# Altium project SNA.PrjPcb (part 2 of 2)

## Sheet 3 RF Source.SchDoc: RF Source
size A3; PageSetup: Record=PageOptions|CenterHorizontal=True|CenterVertical=True|PrintScale=1.01|XCorrection=1.00|YCorrection=1.00|PrintKind=2|BorderSize=5000000|LeftOffset=0|BottomOffset=0|Orientation=2|PaperLength=1000|PaperWidth=1000|Scale=100|PaperSource=15|PrintQuality=600|MediaType=1|DitherType=10|PaperKind=A3|PrintScaleMode=1; DocumentNumber: 4; SheetNumber: 4; SheetTotal: 7
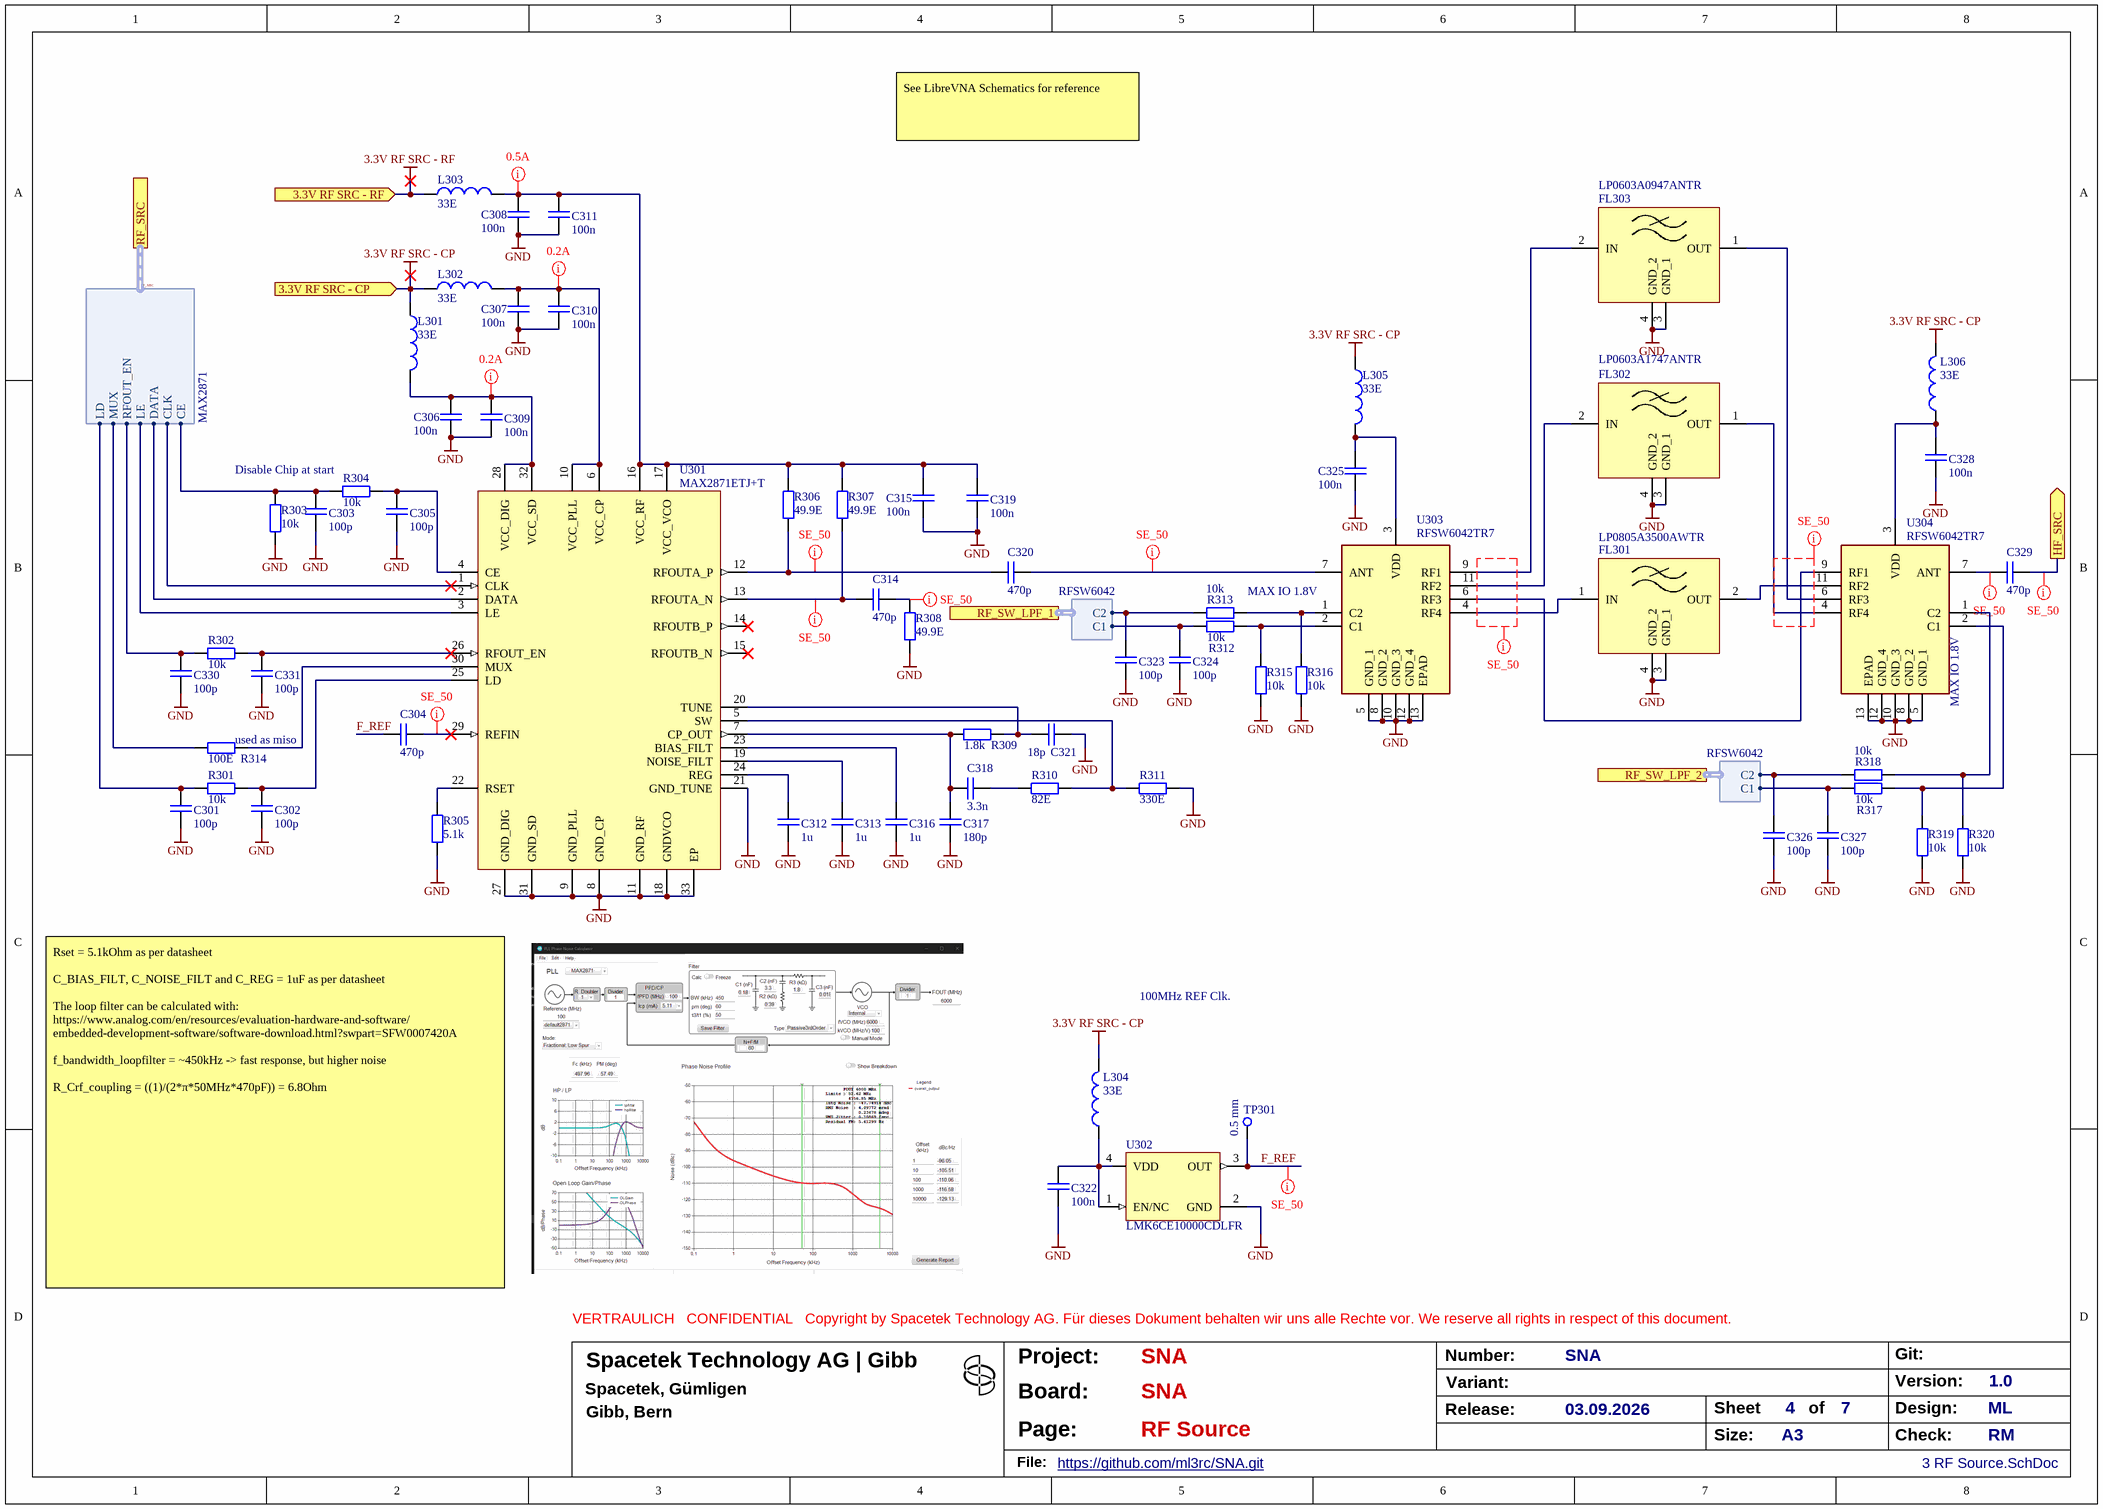
[diagram p3: 3 RF Source.SchDoc]

### Parts
C301  100p  [STT--CC--0402]
C302  100p  [STT--CC--0402]
C303  100p  [STT--CC--0402]
C304  470p  [STT--CC--0402]
C305  100p  [STT--CC--0402]
C306  100n  [STT--CC--0402]
C307  100n  [STT--CC--0402]
C308  100n  [STT--CC--0402]
C309  100n  [STT--CC--0402]
C310  100n  [STT--CC--0402]
C311  100n  [STT--CC--0402]
C312  1u  [STT--CC--0603]
C313  1u  [STT--CC--0603]
C314  470p  [STT--CC--0402]
C315  100n  [STT--CC--0402]
C316  1u  [STT--CC--0603]
C317  180p  [STT--CC--0402]
C318  3.3n  [STT--CC--0402]
C319  100n  [STT--CC--0402]
C320  470p  [STT--CC--0402]
C321  18p  [STT--CC--0402]
C322  100n  [STT--CC--0402]
C323  100p  [STT--CC--0402]
C324  100p  [STT--CC--0402]
C325  100n  [STT--CC--0402]
C326  100p  [STT--CC--0402]
C327  100p  [STT--CC--0402]
C328  100n  [STT--CC--0402]
C329  470p  [STT--CC--0402]
C330  100p  [STT--CC--0402]
C331  100p  [STT--CC--0402]
FL301  LP0805A3500AWTR  [KA--LP0805A]
FL302  LP0603A1747ANTR  [KA--LP0603A]
FL303  LP0603A0947ANTR  [KA--LP0603A]
L301  33E  [STT--FB--0402]
L302  33E  [STT--FB--0402]
L303  33E  [STT--FB--0402]
L304  33E  [STT--FB--0402]
L305  33E  [STT--FB--0402]
L306  33E  [STT--FB--0402]
R301  10k  [STT--RC--0402]
R302  10k  [STT--RC--0402]
R303  10k  [STT--RC--0402]
R304  10k  [STT--RC--0402]
R305  5.1k  [STT--RC--0402]
R306  49.9E  [STT--RC--0402]
R307  49.9E  [STT--RC--0402]
R308  49.9E  [STT--RC--0402]
R309  1.8k  [STT--RC--0402]
R310  82E  [STT--RC--0402]
R311  330E  [STT--RC--0402]
R312  10k  [STT--RC--0402]
R313  10k  [STT--RC--0402]
R314  100E  [STT--RC--0402]
R315  10k  [STT--RC--0402]
R316  10k  [STT--RC--0402]
R317  10k  [STT--RC--0402]
R318  10k  [STT--RC--0402]
R319  10k  [STT--RC--0402]
R320  10k  [STT--RC--0402]
TP301  0.5 mm  [STT--DO--TP-0.5]  (no BOM)
U301  MAX2871ETJ+T  [AD-IC-MAX2871ETJ+T]
U302  LMK6CE10000CDLFR  [TXI-IC-LMK6CE10000CDLFR]
U303  RFSW6042TR7  [QV--IC--QFN-12]
U304  RFSW6042TR7  [QV--IC--QFN-12]

### Ports
3.3V RF SRC - CP (in), 3.3V RF SRC - RF (in), HF_SRC (out), RF_SRC (harness MAX2871), RF_SW_LPF_1 (harness RFSW6042), RF_SW_LPF_2 (harness RFSW6042)

### Harnesses
RFSW6042: C1, C2
MAX2871: CE, CLK, DATA, LE, RFOUT_EN, MUX, LD

### Nets
3.3V RF SRC - CP: L301.1 L302.1 L304.2 L305.1 L306.1 ; port 3.3V RF SRC - CP
3.3V RF SRC - RF: L303.1 ; port 3.3V RF SRC - RF
GND: C301.1 C302.1 C303.1 C305.1 C306.2 C307.2 C308.2 C309.2 C310.2 C311.2 C312.1 C313.1 C315.2 C316.1 C317.1 C319.2 C321.2 C322.1 C323.1 C324.1 C325.2 C326.1 C327.1 C328.2 C330.1 C331.1 FL301.3(GND_1) FL301.4(GND_2) FL302.3(GND_1) FL302.4(GND_2) FL303.3(GND_1) FL303.4(GND_2) R303.2 R305.1 R308.1 R311.2 R315.2 R316.2 R319.2 R320.2 U301.8(GND_CP) U301.9(GND_PLL) U301.11(GND_RF) U301.18(GNDVCO) U301.21(GND_TUNE) U301.27(GND_DIG) U301.31(GND_SD) U301.33(EP) U302.2(GND) U303.5(GND_1) U303.8(GND_2) U303.10(GND_3) U303.12(GND_4) U303.13(EPAD) U304.5(GND_1) U304.8(GND_2) U304.10(GND_3) U304.12(GND_4) U304.13(EPAD)
F_REF: C304.1 TP301.1 U302.3(OUT)
RF_SRC.CE: C303.2 R303.1 R304.2 ; port RF_SRC.CE
RF_SRC.CLK: U301.1(CLK) ; port RF_SRC.CLK
RF_SRC.DATA: U301.2(DATA) ; port RF_SRC.DATA
RF_SRC.LD: C301.2 R301.2 ; port RF_SRC.LD
RF_SRC.LE: U301.3(LE) ; port RF_SRC.LE
RF_SRC.MUX: R314.1 ; port RF_SRC.MUX
RF_SRC.RFOUT_EN: C330.2 R302.2 ; port RF_SRC.RFOUT_EN
RF_SW_LPF_1.C1: C324.2 R312.1 ; port RF_SW_LPF_1.C1
RF_SW_LPF_1.C2: C323.2 R313.1 ; port RF_SW_LPF_1.C2
RF_SW_LPF_2.C1: C327.2 R317.1 ; port RF_SW_LPF_2.C1
RF_SW_LPF_2.C2: C326.2 R318.1 ; port RF_SW_LPF_2.C2
NetC302_2: C302.2 R301.1 U301.25(LD)
NetC304_2: C304.2 U301.29(REFIN)
NetC305_2: C305.2 R304.1 U301.4(CE)
NetC306_1: C306.1 C309.1 L301.2 U301.28(VCC_DIG) U301.32(VCC_SD)
NetC307_1: C307.1 C310.1 L302.2 U301.6(VCC_CP) U301.10(VCC_PLL)
NetC308_1: C308.1 C311.1 C315.1 C319.1 L303.2 R306.2 R307.2 U301.16(VCC_RF) U301.17(VCC_VCO)
NetC312_2: C312.2 U301.24(REG)
NetC313_2: C313.2 U301.19(NOISE_FILT)
NetC314_1: C314.1 R307.1 U301.13(RFOUTA_N)
NetC314_2: C314.2 R308.2
NetC316_2: C316.2 U301.23(BIAS_FILT)
NetC317_2: C317.2 C318.1 R309.1 U301.7(CP_OUT)
NetC318_2: C318.2 R310.2
NetC320_1: C320.1 R306.1 U301.12(RFOUTA_P)
NetC320_2: C320.2 U303.7(ANT)
NetC321_1: C321.1 R309.2 U301.20(TUNE)
NetC322_2: C322.2 L304.1 U302.1(EN/NC) U302.4(VDD)
NetC325_1: C325.1 L305.2 U303.3(VDD)
NetC328_1: C328.1 L306.2 U304.3(VDD)
NetC329_1: C329.1 U304.7(ANT)
NetC329_2: C329.2 ; port HF_SRC
NetC331_2: C331.2 R302.1 U301.26(RFOUT_EN)
NetFL301_1: FL301.1(IN) U303.4(RF4)
NetFL301_2: FL301.2(OUT) U304.11(RF2)
NetFL302_1: FL302.1(OUT) U304.4(RF4)
NetFL302_2: FL302.2(IN) U303.11(RF2)
NetFL303_1: FL303.1(OUT) U304.6(RF3)
NetFL303_2: FL303.2(IN) U303.9(RF1)
NetR305_2: R305.2 U301.22(RSET)
NetR310_1: R310.1 R311.1 U301.5(SW)
NetR312_2: R312.2 R315.1 U303.2(C1)
NetR313_2: R313.2 R316.1 U303.1(C2)
NetR314_2: R314.2 U301.30(MUX)
NetR317_2: R317.2 R319.1 U304.2(C1)
NetR318_2: R318.2 R320.1 U304.1(C2)
NetU303_6: U303.6(RF3) U304.9(RF1)

Not connected (* = marked no-connect by the designer): U301 14(RFOUTB_P)* 15(RFOUTB_N)*

### Buses and harness runs
harness RF_SRC = port RF_SRC
harness RF_SW_LPF_1 = port RF_SW_LPF_1
harness RF_SW_LPF_2 = port RF_SW_LPF_2

### Layout directives
net class SE_50: (no net found under the mark), F_REF, NetC304_2, NetC314_1, NetC314_2, NetC320_1, NetC320_2, NetC329_1, NetC329_2
net class 0.5A: NetC308_1
net class 0.2A: NetC306_1, NetC307_1

### Notes on the sheet
- See LibreVNA Schematics for reference
- (near R304) Disable Chip at start
- MAX IO 1.8V
- (near U304) MAX IO 1.8V
- (near R314) used as miso
- 100MHz REF Clk.
- Rset = 5.1kOhm as per datasheet
  C_BIAS_FILT, C_NOISE_FILT and C_REG = 1uF as per datasheet
  The loop filter can be calculated with:
  https://www.analog.com/en/resources/evaluation-hardware-and-software/
  embedded-development-software/software-download.html?swpart=SFW0007420A
  f_bandwidth_loopfilter = ~450kHz -> fast response, but higher noise
  R_Crf_coupling = ((1)/(2*π*50MHz*470pF)) = 6.8Ohm
- VERTRAULICH   CONFIDENTIAL   Copyright by Spacetek Technology AG. Für dieses Dokument behalten wir uns alle Rechte vor. We reserve all rights in respect of this document.
- Project:
- Number:
- Variant:
- Version:
- Git:
- Board:
- Page:
- Release:
- Size:
- Sheet
- A3
- of
- Design:
- Check:
- File:

### Library data of the parts
C301-C303 C305 C323 C324 C326 C327 C330 C331 = CMP-010-000109-1: as C105 on sheet 1 Power; Package: SMD--0402; Status: released; Type: Capacitor ceramic; Value: 100p
C304 C314 C320 C329 = CMP-010-000105-1: Capacitor ceramic 470p 50V 5% C0G  SMD--0402; Manufacturer: TDK; Partnumber: CGA2B2C0G1H471J050BA; Component Category: Generic; Meta Data Version: v1.0; Status: released; Value: 470p
C306-C311 C315 C319 C322 C325 C328 = 200032-3: as C127 on sheet 1 Power; Material: X7R; Voltage: 16V; Type: Capacitor ceramic; Tolerance: 10%; Status: released; Package: SMD--0402; Value: 100n
C312 C313 C316 = CMP-010-000042-2: CAP CER 1UF 35V X7R 0603 10%; Manufacturer: TDK Corporation; Partnumber: C1608X7R1V105K080AC; Special: 0603 SMD; Value: 1u; E-Nummer: -; Status: released
C317 = CMP-010-000104-2: Capacitor ceramic 180p 50V 5% C0G  SMD--0402; Partnumber: CL05C181JB5NNNC; Manufacturer: Samsung Electro-Mechanics; Component Category: Generic; Meta Data Version: v1.0; Value: 180p; Tolerance: 5%; Status: released; Type: Capacitor ceramic; Voltage: 50V; Material: C0G; Package: SMD--0402
C318 = CMP-010-000108-1: Capacitor ceramic 3.3n 50V 10% X7R AEC-Q200 SMD--0402; Partnumber: CL05B332KB5VPNC; Manufacturer: Samsung Electro-Mechanics; Component Category: Generic; Meta Data Version: v1.0; Package: SMD--0402; Status: released; Value: 3.3n; Type: Capacitor ceramic
C321 = 200042-1: Capacitor ceramic 18p 50V 5% C0G  SMD--0402; Partnumber: CL05C180JB5NNNC; Manufacturer: Samsung Electro-Mechanics; A-Number: 200042; Voltage: 50V; Type: Capacitor ceramic; Tolerance: 5%; Package: SMD--0402; Material: C0G; Status: released; Value: 18p
FL301 = CMP-011-000006-1: Low Pass Filter 3500MHz 50 Ohms; Manufacturer: KYOCERA AVX; Component Category: Generic; Meta Data Version: v1.0; Partnumber: LP0805A3500AWTR; Value: LP0805A3500AWTR; Status: released
FL302 = CMP-011-000005-4: Low Pass Filter 1747MHz 50 Ohms; Manufacturer: KYOCERA AVX; Component Category: Generic; Meta Data Version: v1.0; Partnumber: LP0603A1747ANTR; Status: released; Value: LP0603A1747ANTR
FL303 = CMP-011-000007-2: Low Pass Filter 947MHz 50 Ohms; Manufacturer: KYOCERA AVX; Component Category: Generic; Meta Data Version: v1.0; Partnumber: LP0603A0947ANTR; Value: LP0603A0947ANTR; Status: released
L301-L306 = 300015-1: as L105 on sheet 1 Power; Status: active; Current: 3A; Type: Ferrit Bead; Value: 33E; Package: MPZ1005S330HT000; Special: 22mE; Partnumber: MPZ1005S330HT000
R301-R304 R312 R313 R315-R320 = 100086-1: as R204 on sheet 2 MCU; Power: 0.063W; Status: released; Type: Resistor; Voltage: 50V; Tolerance: 1%; Value: 10k; Package: SMD--0402
R305 = CMP-009-000042-2: Resistor 5.1k 50V  0.063W 1%  SMD--0402; Partnumber: ERJ-2RKF5101X; Manufacturer: Panasonic; Value: 5.1k; Tolerance: 1%; Package: SMD--0402; Power: 0.063W; Status: released; Voltage: 50V; Type: Resistor
R306-R308 = CMP-009-000262-1: Resistor 49.9E 50V 0.1W 1% SMD--0402; Partnumber: RNCP0402FTD49R9; Manufacturer: SEI Stackpole; Component Category: Generic; Meta Data Version: v1.0; Value: 49.9E; Status: released
R309 = CMP-009-000258-1: Resistor 1.8k 50V  0.063W 1%  SMD--0402; Manufacturer: SEI Stackpole; Partnumber: RMCF0402FT1K80; Component Category: Generic; Meta Data Version: v1.0; Power: 0.063W; Package: SMD--0402; Value: 1.8k; Voltage: 50V; Type: Resistor; Tolerance: 1%; Status: released
R310 = CMP-009-000257-2: Resistor 82E 25V  0.063W 0.5%  SMD--0402; Partnumber: RR0510R-820-D; Manufacturer: Vishay; Meta Data Version: v1.0; Component Category: Generic; Type: Resistor; Status: released; Value: 82E
R311 = 100076-2: Resistor 330E 50V  0.063W 1%  SMD--0402; Partnumber: ERJ-2RKF3300X; Manufacturer: Panasonic; A-Number: 100076; Power: 0.063W; Type: Resistor; Voltage: 50V; Value: 330E; Package: SMD--0402; Tolerance: 1%; Status: released
R314 = 100068-1: Resistor 100E 50V  0.063W 0.01  SMD--0402; Partnumber: CRCW0402100RFKEDC; Manufacturer: Vishay; A-Number: 100068; Tolerance: 0.01; Power: 0.063W; Package: SMD--0402; Value: 100E; Status: released; Type: Resistor; Voltage: 50V
TP301 = CMP-043-000000-4: Pad TP SMD--Pad 0.5; Special: 0.5; preferred: Yes; Status: active; Partnumber: TP; Value: 0.5 mm; Package: SMD--Pad; Type: Pad
U301 = CMP-038-000007-2: MAX2871ETJ+T PLL 23.5MHz to 6000MHz; Manufacturer: Analog Devices; Meta Data Version: v1.0; Component Category: generic; Type: Oscillator; Partnumber: MAX2871ETJ+T; Status: released; Value: 23.5MHz to 6000MHz
U302 = CMP-038-000005-2: LMK6CE10000CDLFR low jitter 100MHz 3.3V LVCMOS, no load max.: 62mA; Manufacturer: Texas Instruments; Meta Data Version: Meta Data Version v1.0; Voltage: 2.5V - 3.3 V; Component Category: Generic; Value: 100 MHz; Special: LVCMOS; Type: Oscillator; Status: released; Partnumber: LMK6CE10000CDLFR
U303 U304 = CMP-081-000011-1: RF Switch RFSW6042TR7  5-6000MHz SP4T Iso 36dB @925MHz; Manufacturer: Qorvo; Component Category: Generic; Meta Data Version: v1.0; Partnumber: RFSW6042TR7; Status: released; Value: RFSW6042TR7; Type: RF-Switch

## Sheet 4 RF Attenuation Amp.SchDoc: RF Attenuation Amp
size A3; PageSetup: Record=PageOptions|CenterHorizontal=True|CenterVertical=True|PrintScale=1.01|XCorrection=1.00|YCorrection=1.00|PrintKind=2|BorderSize=5000000|LeftOffset=0|BottomOffset=0|Orientation=2|PaperLength=1000|PaperWidth=1000|Scale=100|PaperSource=15|PrintQuality=600|MediaType=1|DitherType=10|PaperKind=A3|PrintScaleMode=1; DocumentNumber: 4; SheetNumber: 5; SheetTotal: 7
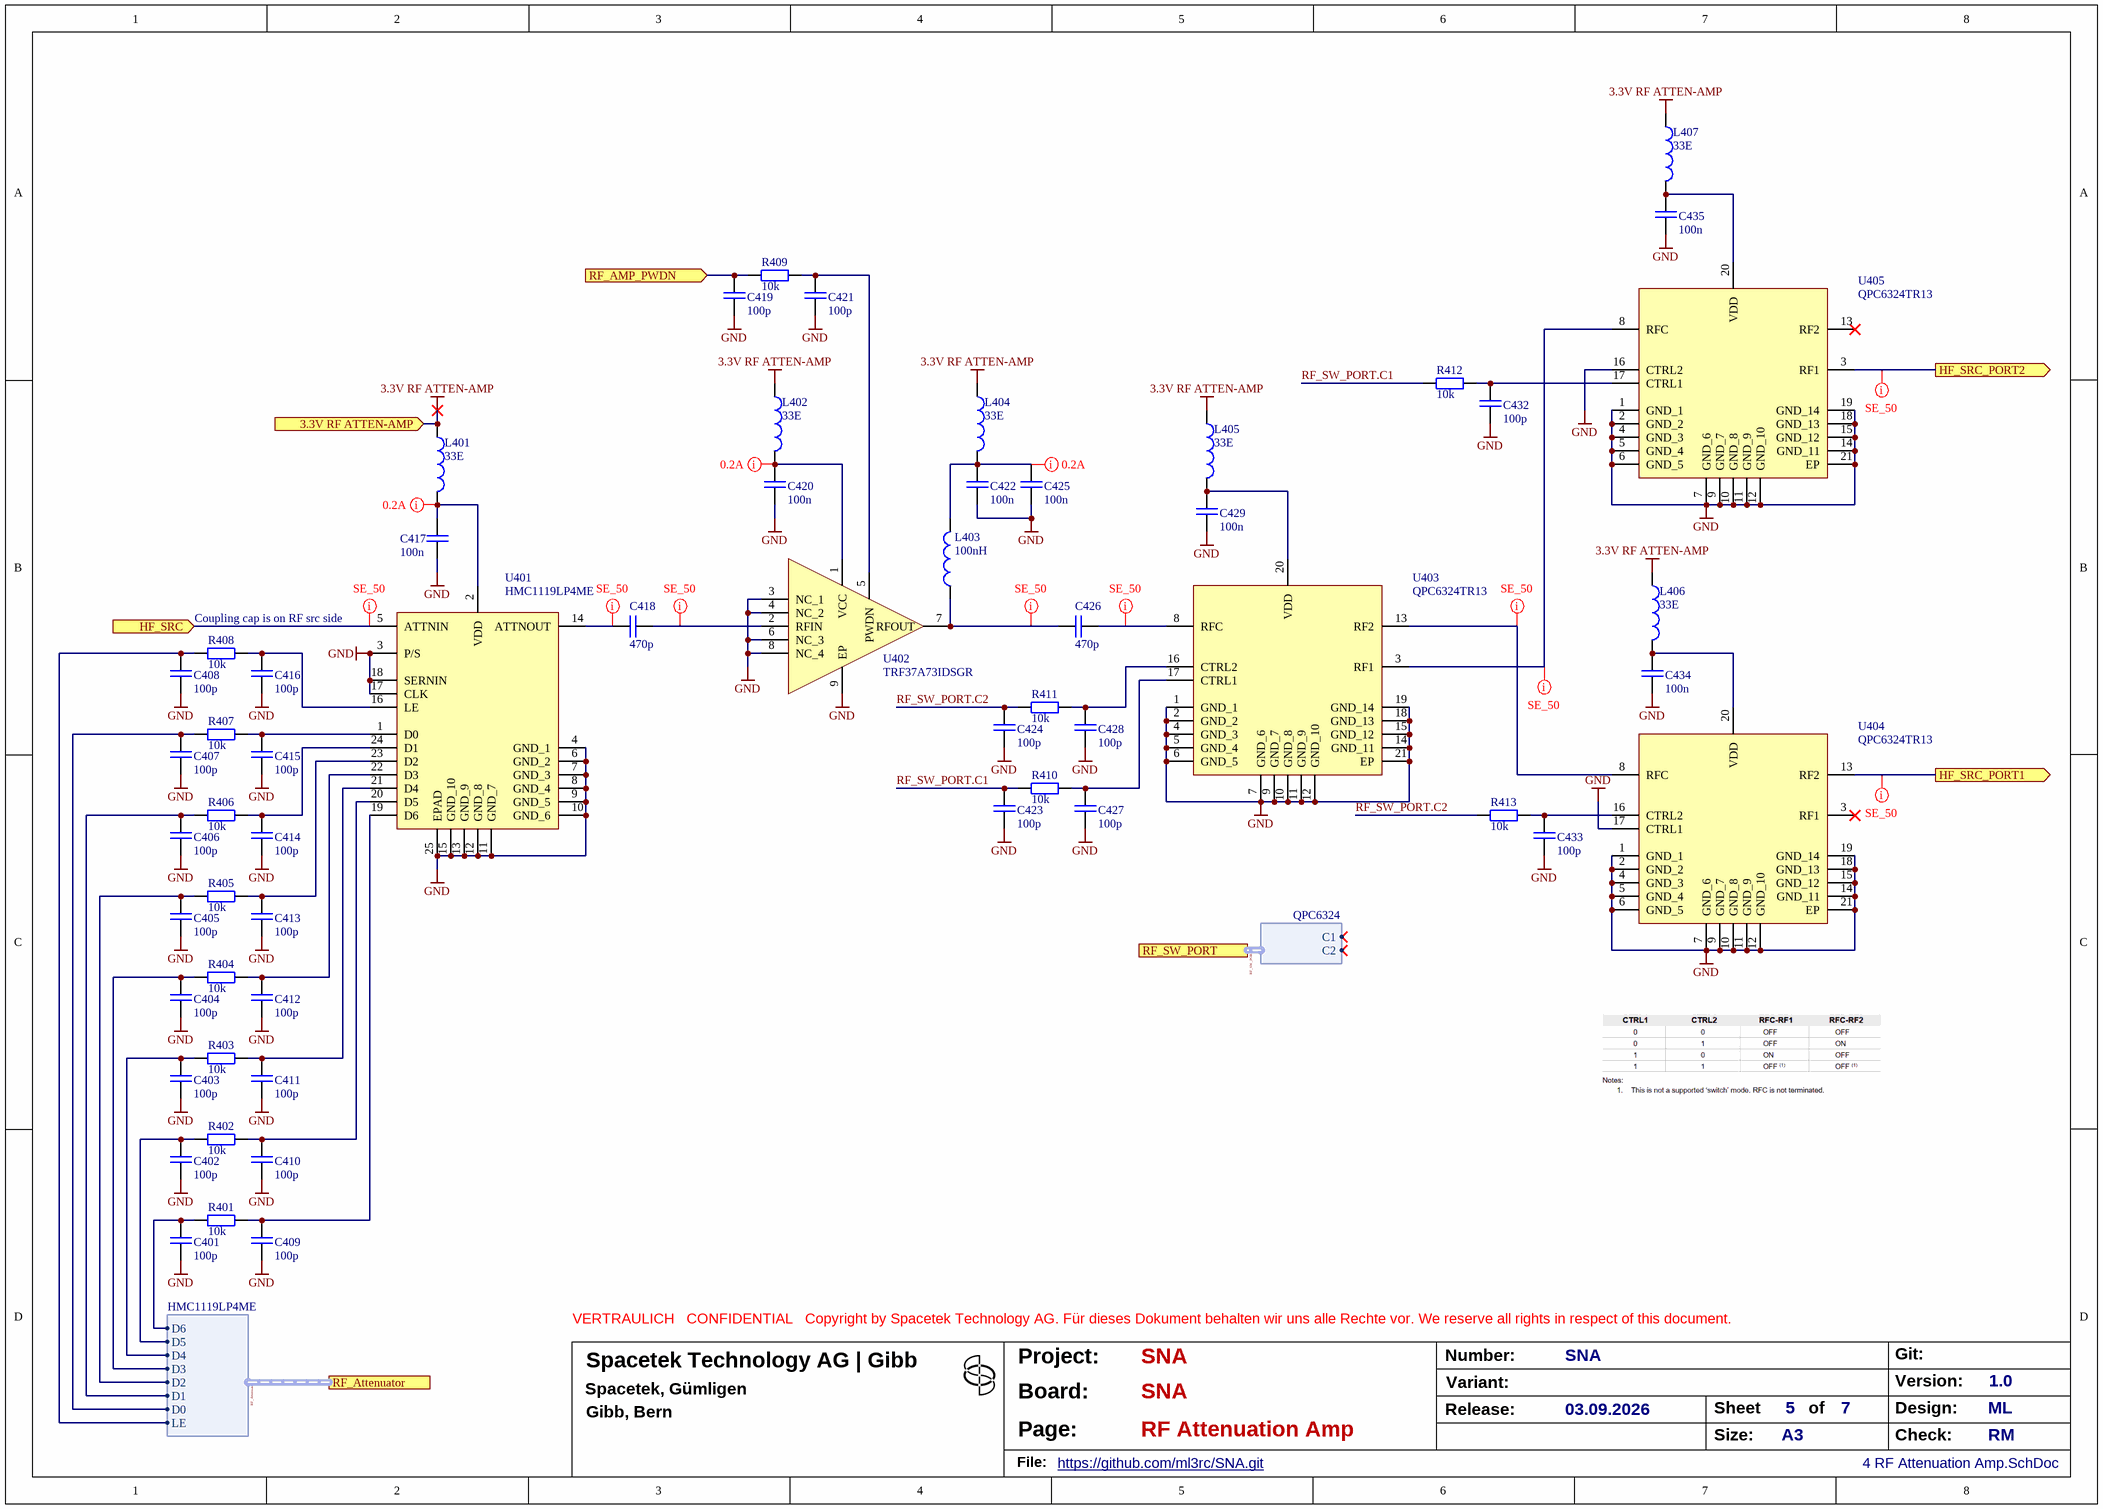
[diagram p4: 4 RF Attenuation Amp.SchDoc]

### Parts
C401  100p  [STT--CC--0402]
C402  100p  [STT--CC--0402]
C403  100p  [STT--CC--0402]
C404  100p  [STT--CC--0402]
C405  100p  [STT--CC--0402]
C406  100p  [STT--CC--0402]
C407  100p  [STT--CC--0402]
C408  100p  [STT--CC--0402]
C409  100p  [STT--CC--0402]
C410  100p  [STT--CC--0402]
C411  100p  [STT--CC--0402]
C412  100p  [STT--CC--0402]
C413  100p  [STT--CC--0402]
C414  100p  [STT--CC--0402]
C415  100p  [STT--CC--0402]
C416  100p  [STT--CC--0402]
C417  100n  [STT--CC--0402]
C418  470p  [STT--CC--0402]
C419  100p  [STT--CC--0402]
C420  100n  [STT--CC--0402]
C421  100p  [STT--CC--0402]
C422  100n  [STT--CC--0402]
C423  100p  [STT--CC--0402]
C424  100p  [STT--CC--0402]
C425  100n  [STT--CC--0402]
C426  470p  [STT--CC--0402]
C427  100p  [STT--CC--0402]
C428  100p  [STT--CC--0402]
C429  100n  [STT--CC--0402]
C432  100p  [STT--CC--0402]
C433  100p  [STT--CC--0402]
C434  100n  [STT--CC--0402]
C435  100n  [STT--CC--0402]
L401  33E  [STT--FB--0402]
L402  33E  [STT--FB--0402]
L403  100nH  [STT--RC--0603]
L404  33E  [STT--FB--0402]
L405  33E  [STT--FB--0402]
L406  33E  [STT--FB--0402]
L407  33E  [STT--FB--0402]
R401  10k  [STT--RC--0402]
R402  10k  [STT--RC--0402]
R403  10k  [STT--RC--0402]
R404  10k  [STT--RC--0402]
R405  10k  [STT--RC--0402]
R406  10k  [STT--RC--0402]
R407  10k  [STT--RC--0402]
R408  10k  [STT--RC--0402]
R409  10k  [STT--RC--0402]
R410  10k  [STT--RC--0402]
R411  10k  [STT--RC--0402]
R412  10k  [STT--RC--0402]
R413  10k  [STT--RC--0402]
U401  HMC1119LP4ME  [ADI--IC--LFCSP-24]
U402  TRF37A73IDSGR  [TI--IC--WSON-8]
U403  QPC6324TR13  [QV--IC--QFN-20]
U404  QPC6324TR13  [QV--IC--QFN-20]
U405  QPC6324TR13  [QV--IC--QFN-20]

### Ports
3.3V RF ATTEN-AMP (in), HF_SRC (in), HF_SRC_PORT1 (out), HF_SRC_PORT2 (out), RF_AMP_PWDN (in), RF_Attenuator (harness HMC1119LP4ME), RF_SW_PORT (harness QPC6324)

### Harnesses
HMC1119LP4ME: D6, D5, D4, D3, D2, D1, LE, D0
QPC6324: C1, C2

### Nets
3.3V RF ATTEN-AMP: L401.1 L402.1 L404.1 L405.1 L406.1 L407.1 ; port 3.3V RF ATTEN-AMP
GND: C401.1 C402.1 C403.1 C404.1 C405.1 C406.1 C407.1 C408.1 C409.1 C410.1 C411.1 C412.1 C413.1 C414.1 C415.1 C416.1 C417.2 C419.1 C420.1 C421.1 C422.1 C423.1 C424.1 C425.1 C427.1 C428.1 C429.1 C432.1 C433.1 C434.1 C435.1 U401.3(P/S) U401.4(GND_1) U401.6(GND_2) U401.7(GND_3) U401.8(GND_4) U401.9(GND_5) U401.10(GND_6) U401.11(GND_7) U401.12(GND_8) U401.13(GND_9) U401.15(GND_10) U401.17(CLK) U401.18(SERNIN) U401.25(EPAD) U402.3(NC_1) U402.4(NC_2) U402.6(NC_3) U402.8(NC_4) U402.9(EP) U403.1(GND_1) U403.2(GND_2) U403.4(GND_3) U403.5(GND_4) U403.6(GND_5) U403.7(GND_6) U403.9(GND_7) U403.10(GND_8) U403.11(GND_9) U403.12(GND_10) U403.14(GND_11) U403.15(GND_12) U403.18(GND_13) U403.19(GND_14) U403.21(EP) U404.1(GND_1) U404.2(GND_2) U404.4(GND_3) U404.5(GND_4) U404.6(GND_5) U404.7(GND_6) U404.9(GND_7) U404.10(GND_8) U404.11(GND_9) U404.12(GND_10) U404.14(GND_11) U404.15(GND_12) U404.17(CTRL1) U404.18(GND_13) U404.19(GND_14) U404.21(EP) U405.1(GND_1) U405.2(GND_2) U405.4(GND_3) U405.5(GND_4) U405.6(GND_5) U405.7(GND_6) U405.9(GND_7) U405.10(GND_8) U405.11(GND_9) U405.12(GND_10) U405.14(GND_11) U405.15(GND_12) U405.16(CTRL2) U405.18(GND_13) U405.19(GND_14) U405.21(EP)
RF_Attenuator.D0: C407.2 R407.2 ; port RF_Attenuator.D0
RF_Attenuator.D1: C406.2 R406.2 ; port RF_Attenuator.D1
RF_Attenuator.D2: C405.2 R405.2 ; port RF_Attenuator.D2
RF_Attenuator.D3: C404.2 R404.2 ; port RF_Attenuator.D3
RF_Attenuator.D4: C403.2 R403.2 ; port RF_Attenuator.D4
RF_Attenuator.D5: C402.2 R402.2 ; port RF_Attenuator.D5
RF_Attenuator.D6: C401.2 R401.2 ; port RF_Attenuator.D6
RF_Attenuator.LE: C408.2 R408.2 ; port RF_Attenuator.LE
RF_SW_PORT.C1: C423.2 R410.2 R412.2
RF_SW_PORT.C2: C424.2 R411.2 R413.2
NetC329_2: U401.5(ATTNIN) ; port HF_SRC
NetC409_2: C409.2 R401.1 U401.19(D6)
NetC410_2: C410.2 R402.1 U401.20(D5)
NetC411_2: C411.2 R403.1 U401.21(D4)
NetC412_2: C412.2 R404.1 U401.22(D3)
NetC413_2: C413.2 R405.1 U401.23(D2)
NetC414_2: C414.2 R406.1 U401.24(D1)
NetC415_2: C415.2 R407.1 U401.1(D0)
NetC416_2: C416.2 R408.1 U401.16(LE)
NetC417_1: C417.1 L401.2 U401.2(VDD)
NetC418_1: C418.1 U401.14(ATTNOUT)
NetC418_2: C418.2 U402.2(RFIN)
NetC419_2: C419.2 R409.1 ; port RF_AMP_PWDN
NetC420_2: C420.2 L402.2 U402.1(VCC)
NetC421_2: C421.2 R409.2 U402.5(PWDN)
NetC422_2: C422.2 C425.2 L403.2 L404.2
NetC426_1: C426.1 L403.1 U402.7(RFOUT)
NetC426_2: C426.2 U403.8(RFC)
NetC427_2: C427.2 R410.1 U403.17(CTRL1)
NetC428_2: C428.2 R411.1 U403.16(CTRL2)
NetC429_2: C429.2 L405.2 U403.20(VDD)
NetC432_2: C432.2 R412.1 U405.17(CTRL1)
NetC433_2: C433.2 R413.1 U404.16(CTRL2)
NetC434_2: C434.2 L406.2 U404.20(VDD)
NetC435_2: C435.2 L407.2 U405.20(VDD)
NetC501_1: U405.3(RF1) ; port HF_SRC_PORT2
NetC502_1: U404.13(RF2) ; port HF_SRC_PORT1
NetU403_3: U403.3(RF1) U405.8(RFC)
NetU403_13: U403.13(RF2) U404.8(RFC)

Not connected (* = marked no-connect by the designer): U404 3(RF1)*; U405 13(RF2)*

### Buses and harness runs
harness RF_Attenuator = port RF_Attenuator
harness RF_SW_PORT = port RF_SW_PORT

### Layout directives
net class SE_50: NetC329_2, NetC418_1, NetC418_2, NetC426_1, NetC426_2, NetC501_1, NetC502_1, NetU403_3, NetU403_13
net class 0.2A: NetC417_1, NetC420_2, NetC422_2

### Notes on the sheet
- Coupling cap is on RF src side
- VERTRAULICH   CONFIDENTIAL   Copyright by Spacetek Technology AG. Für dieses Dokument behalten wir uns alle Rechte vor. We reserve all rights in respect of this document.
- Project:
- Number:
- Variant:
- Version:
- Git:
- Board:
- Page:
- Release:
- Size:
- Sheet
- A3
- of
- Design:
- Check:
- File:

### Library data of the parts
C401-C416 C419 C421 C423 C424 C427 C428 C432 C433 = CMP-010-000109-1: as C105 on sheet 1 Power; Package: SMD--0402; Status: released; Type: Capacitor ceramic; Value: 100p
C417 C420 C422 C425 C429 C434 C435 = 200032-3: as C127 on sheet 1 Power; Material: X7R; Voltage: 16V; Type: Capacitor ceramic; Tolerance: 10%; Status: released; Package: SMD--0402; Value: 100n
C418 C426 = CMP-010-000105-1: as C304 on sheet 3 RF Source; Status: released; Value: 470p
L401 L402 L404-L407 = 300015-1: as L105 on sheet 1 Power; Status: active; Current: 3A; Type: Ferrit Bead; Value: 33E; Package: MPZ1005S330HT000; Special: 22mE; Partnumber: MPZ1005S330HT000
L403 = CMP-012-000031-2: Inductor 100nH 290mA AEC-Q200  SMD--0603; Manufacturer: Coilcraft; Partnumber: 0603DC-R10XJRW; Component Category: generic; Meta Data Version: v1.0; Type: Inductor; Status: released; Value: 100nH
R401-R413 = 100086-1: as R204 on sheet 2 MCU; Power: 0.063W; Status: released; Type: Resistor; Voltage: 50V; Tolerance: 1%; Value: 10k; Package: SMD--0402
U401 = CMP-153-000013-1: Attenuator HMC1119LP4ME, -2...-32dBm, 0.1-6Ghz; Manufacturer: Analog Devices; Component Category: Generic; Meta Data Version: v1.0; Status: released; Value: HMC1119LP4ME; Partnumber: HMC1119LP4ME; Type: Attenuator
U402 = CMP-153-000014-1: Amp TRF37A73IDSGR, +12dB, 0.1-6Ghz; Manufacturer: Texas Instruments; Component Category: Generic; Meta Data Version: v1.0; Type: Amp; Partnumber: TRF37A73IDSGR; Status: released; Value: TRF37A73IDSGR
U403-U405 = CMP-081-000012-1: RF Switch QPC6324TR13  5-6000MHz SPDT; Manufacturer: Qorvo; Component Category: Generic; Meta Data Version: v1.0; Value: QPC6324TR13; Partnumber: QPC6324TR13; Status: released; Type: RF-Switch

## Sheet 5 RF Directional Coupler.SchDoc: RF Directional Coupler
size A3; PageSetup: Record=PageOptions|CenterHorizontal=True|CenterVertical=True|PrintScale=1.01|XCorrection=1.00|YCorrection=1.00|PrintKind=2|BorderSize=5000000|LeftOffset=0|BottomOffset=0|Orientation=2|PaperLength=1000|PaperWidth=1000|Scale=100|PaperSource=15|PrintQuality=600|MediaType=1|DitherType=10|PaperKind=A3|PrintScaleMode=1; DocumentNumber: 4; SheetNumber: 6; SheetTotal: 7
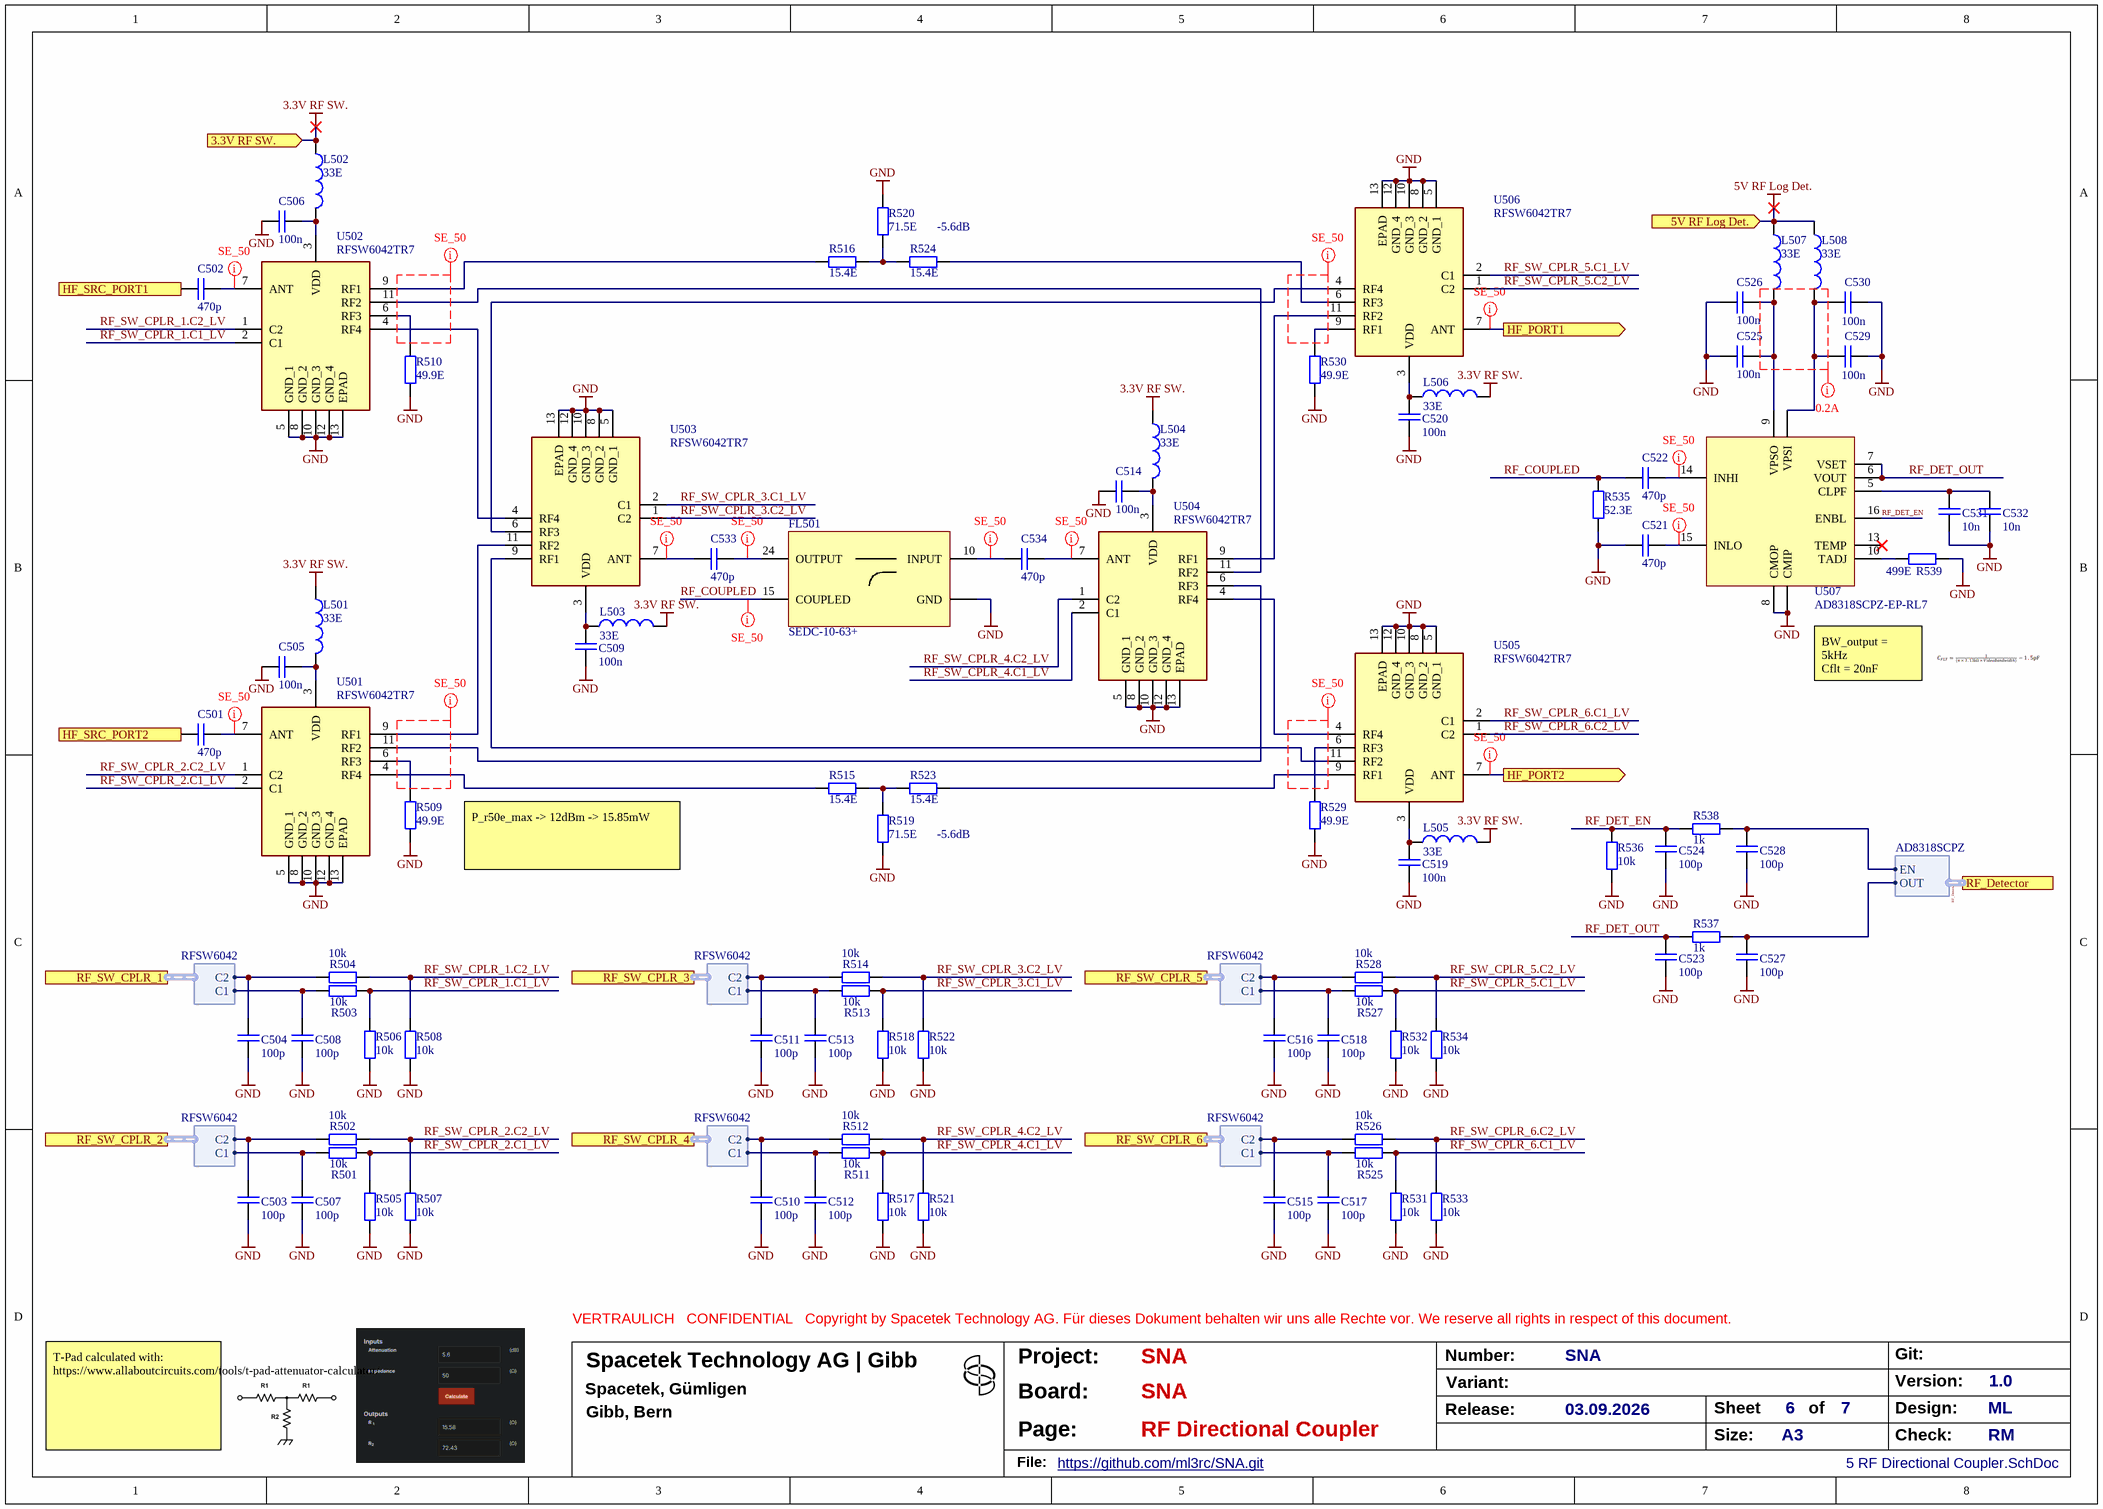
[diagram p5: 5 RF Directional Coupler.SchDoc]

### Parts
C501  470p  [STT--CC--0402]
C502  470p  [STT--CC--0402]
C503  100p  [STT--CC--0402]
C504  100p  [STT--CC--0402]
C505  100n  [STT--CC--0402]
C506  100n  [STT--CC--0402]
C507  100p  [STT--CC--0402]
C508  100p  [STT--CC--0402]
C509  100n  [STT--CC--0402]
C510  100p  [STT--CC--0402]
C511  100p  [STT--CC--0402]
C512  100p  [STT--CC--0402]
C513  100p  [STT--CC--0402]
C514  100n  [STT--CC--0402]
C515  100p  [STT--CC--0402]
C516  100p  [STT--CC--0402]
C517  100p  [STT--CC--0402]
C518  100p  [STT--CC--0402]
C519  100n  [STT--CC--0402]
C520  100n  [STT--CC--0402]
C521  470p  [STT--CC--0402]
C522  470p  [STT--CC--0402]
C523  100p  [STT--CC--0402]
C524  100p  [STT--CC--0402]
C525  100n  [STT--CC--0402]
C526  100n  [STT--CC--0402]
C527  100p  [STT--CC--0402]
C528  100p  [STT--CC--0402]
C529  100n  [STT--CC--0402]
C530  100n  [STT--CC--0402]
C531  10n  [STT--CC--0402]
C532  10n  [STT--CC--0402]
C533  470p  [STT--CC--0402]
C534  470p  [STT--CC--0402]
FL501  SEDC-10-63+  [MC--SEDC-10-63+]
L501  33E  [STT--FB--0402]
L502  33E  [STT--FB--0402]
L503  33E  [STT--FB--0402]
L504  33E  [STT--FB--0402]
L505  33E  [STT--FB--0402]
L506  33E  [STT--FB--0402]
L507  33E  [STT--FB--0402]
L508  33E  [STT--FB--0402]
R501  10k  [STT--RC--0402]
R502  10k  [STT--RC--0402]
R503  10k  [STT--RC--0402]
R504  10k  [STT--RC--0402]
R505  10k  [STT--RC--0402]
R506  10k  [STT--RC--0402]
R507  10k  [STT--RC--0402]
R508  10k  [STT--RC--0402]
R509  49.9E  [STT--RC--0402]
R510  49.9E  [STT--RC--0402]
R511  10k  [STT--RC--0402]
R512  10k  [STT--RC--0402]
R513  10k  [STT--RC--0402]
R514  10k  [STT--RC--0402]
R515  15.4E  [STT--RC--0402]
R516  15.4E  [STT--RC--0402]
R517  10k  [STT--RC--0402]
R518  10k  [STT--RC--0402]
R519  71.5E  [STT--RC--0402]
R520  71.5E  [STT--RC--0402]
R521  10k  [STT--RC--0402]
R522  10k  [STT--RC--0402]
R523  15.4E  [STT--RC--0402]
R524  15.4E  [STT--RC--0402]
R525  10k  [STT--RC--0402]
R526  10k  [STT--RC--0402]
R527  10k  [STT--RC--0402]
R528  10k  [STT--RC--0402]
R529  49.9E  [STT--RC--0402]
R530  49.9E  [STT--RC--0402]
R531  10k  [STT--RC--0402]
R532  10k  [STT--RC--0402]
R533  10k  [STT--RC--0402]
R534  10k  [STT--RC--0402]
R535  52.3E  [STT--RC--0402]
R536  10k  [STT--RC--0402]
R537  1k  [STT--RC--0402]
R538  1k  [STT--RC--0402]
R539  499E  [STT--RC--0402]
U501  RFSW6042TR7  [QV--IC--QFN-12]
U502  RFSW6042TR7  [QV--IC--QFN-12]
U503  RFSW6042TR7  [QV--IC--QFN-12]
U504  RFSW6042TR7  [QV--IC--QFN-12]
U505  RFSW6042TR7  [QV--IC--QFN-12]
U506  RFSW6042TR7  [QV--IC--QFN-12]
U507  AD8318SCPZ-EP-RL7  [ADI--AD8318SCPZ-EP-RL7]

### Ports
3.3V RF SW. (in), 5V RF Log Det. (in), HF_PORT1 (out), HF_PORT2 (out), HF_SRC_PORT1 (in), HF_SRC_PORT2 (in), RF_Detector (harness AD8318SCPZ), RF_SW_CPLR_1 (harness RFSW6042), RF_SW_CPLR_2 (harness RFSW6042), RF_SW_CPLR_3 (harness RFSW6042), RF_SW_CPLR_4 (harness RFSW6042), RF_SW_CPLR_5 (harness RFSW6042), RF_SW_CPLR_6 (harness RFSW6042)

### Harnesses
RFSW6042: C1, C2
AD8318SCPZ: EN, OUT

### Nets
3.3V RF SW.: L501.1 L502.1 L503.1 L504.1 L505.1 L506.1 ; port 3.3V RF SW.
5V RF Log Det.: L507.1 L508.1 ; port 5V RF Log Det.
GND: C503.1 C504.1 C505.1 C506.1 C507.1 C508.1 C509.1 C510.1 C511.1 C512.1 C513.1 C514.1 C515.1 C516.1 C517.1 C518.1 C519.1 C520.1 C521.1 C523.1 C524.1 C525.1 C526.1 C527.1 C528.1 C529.1 C530.1 C531.1 C532.1 FL501.1,2,3,4,5,6,7,8,9,11,12,13,14,16,17,18,19,20,21,22,23,25(GND) R505.2 R506.2 R507.2 R508.2 R509.1 R510.1 R517.2 R518.2 R519.1 R520.1 R521.2 R522.2 R529.1 R530.1 R531.2 R532.2 R533.2 R534.2 R535.1 R536.1 R539.2 U501.5(GND_1) U501.8(GND_2) U501.10(GND_3) U501.12(GND_4) U501.13(EPAD) U502.5(GND_1) U502.8(GND_2) U502.10(GND_3) U502.12(GND_4) U502.13(EPAD) U503.5(GND_1) U503.8(GND_2) U503.10(GND_3) U503.12(GND_4) U503.13(EPAD) U504.5(GND_1) U504.8(GND_2) U504.10(GND_3) U504.12(GND_4) U504.13(EPAD) U505.5(GND_1) U505.8(GND_2) U505.10(GND_3) U505.12(GND_4) U505.13(EPAD) U506.5(GND_1) U506.8(GND_2) U506.10(GND_3) U506.12(GND_4) U506.13(EPAD) U507.1,2,11,12,17(CMIP) U507.8(CMOP)
RF_COUPLED: C522.1 FL501.15(COUPLED) R535.2
RF_DET_EN: C524.2 R536.2 R538.1 U507.16(ENBL)
RF_DET_OUT: C523.2 R537.1 U507.6(VOUT) U507.7(VSET)
RF_Detector.EN: C528.2 R538.2 ; port RF_Detector.EN
RF_Detector.OUT: C527.2 R537.2 ; port RF_Detector.OUT
RF_SW_CPLR_1.C1: C508.2 R503.1 ; port RF_SW_CPLR_1.C1
RF_SW_CPLR_1.C1_LV: R503.2 R506.1 U502.2(C1)
RF_SW_CPLR_1.C2: C504.2 R504.1 ; port RF_SW_CPLR_1.C2
RF_SW_CPLR_1.C2_LV: R504.2 R508.1 U502.1(C2)
RF_SW_CPLR_2.C1: C507.2 R501.1 ; port RF_SW_CPLR_2.C1
RF_SW_CPLR_2.C1_LV: R501.2 R505.1 U501.2(C1)
RF_SW_CPLR_2.C2: C503.2 R502.1 ; port RF_SW_CPLR_2.C2
RF_SW_CPLR_2.C2_LV: R502.2 R507.1 U501.1(C2)
RF_SW_CPLR_3.C1: C513.2 R513.1 ; port RF_SW_CPLR_3.C1
RF_SW_CPLR_3.C1_LV: R513.2 R518.1 U503.2(C1)
RF_SW_CPLR_3.C2: C511.2 R514.1 ; port RF_SW_CPLR_3.C2
RF_SW_CPLR_3.C2_LV: R514.2 R522.1 U503.1(C2)
RF_SW_CPLR_4.C1: C512.2 R511.1 ; port RF_SW_CPLR_4.C1
RF_SW_CPLR_4.C1_LV: R511.2 R517.1 U504.2(C1)
RF_SW_CPLR_4.C2: C510.2 R512.1 ; port RF_SW_CPLR_4.C2
RF_SW_CPLR_4.C2_LV: R512.2 R521.1 U504.1(C2)
RF_SW_CPLR_5.C1: C518.2 R527.1 ; port RF_SW_CPLR_5.C1
RF_SW_CPLR_5.C1_LV: R527.2 R532.1 U506.2(C1)
RF_SW_CPLR_5.C2: C516.2 R528.1 ; port RF_SW_CPLR_5.C2
RF_SW_CPLR_5.C2_LV: R528.2 R534.1 U506.1(C2)
RF_SW_CPLR_6.C1: C517.2 R525.1 ; port RF_SW_CPLR_6.C1
RF_SW_CPLR_6.C1_LV: R525.2 R531.1 U505.2(C1)
RF_SW_CPLR_6.C2: C515.2 R526.1 ; port RF_SW_CPLR_6.C2
RF_SW_CPLR_6.C2_LV: R526.2 R533.1 U505.1(C2)
NetC501_1: C501.1 ; port HF_SRC_PORT2
NetC501_2: C501.2 U501.7(ANT)
NetC502_1: C502.1 ; port HF_SRC_PORT1
NetC502_2: C502.2 U502.7(ANT)
NetC505_2: C505.2 L501.2 U501.3(VDD)
NetC506_2: C506.2 L502.2 U502.3(VDD)
NetC509_2: C509.2 L503.2 U503.3(VDD)
NetC514_2: C514.2 L504.2 U504.3(VDD)
NetC519_2: C519.2 L505.2 U505.3(VDD)
NetC520_2: C520.2 L506.2 U506.3(VDD)
NetC521_2: C521.2 U507.15(INLO)
NetC522_2: C522.2 U507.14(INHI)
NetC525_2: C525.2 C526.2 L507.2 U507.9(VPSO)
NetC529_2: C529.2 C530.2 L508.2 U507.3,4(VPSI)
NetC531_2: C531.2 C532.2 U507.5(CLPF)
NetC533_1: C533.1 U503.7(ANT)
NetC533_2: C533.2 FL501.24(OUTPUT)
NetC534_1: C534.1 FL501.10(INPUT)
NetC534_2: C534.2 U504.7(ANT)
NetR509_2: R509.2 U501.6(RF3)
NetR510_2: R510.2 U502.6(RF3)
NetR515_1: R515.1 U501.4(RF4)
NetR515_2: R515.2 R519.2 R523.1
NetR516_1: R516.1 R520.2 R524.2
NetR516_2: R516.2 U502.9(RF1)
NetR523_2: R523.2 U505.9(RF1)
NetR524_1: R524.1 U506.6(RF3)
NetR529_2: R529.2 U505.6(RF3)
NetR530_2: R530.2 U506.9(RF1)
NetR539_1: R539.1 U507.10(TADJ)
NetU501_9: U501.9(RF1) U503.11(RF2)
NetU501_11: U501.11(RF2) U504.6(RF3)
NetU502_4: U502.4(RF4) U503.4(RF4)
NetU502_11: U502.11(RF2) U504.11(RF2)
NetU503_6: U503.6(RF3) U506.4(RF4)
NetU503_9: U503.9(RF1) U505.11(RF2)
NetU504_4: U504.4(RF4) U505.4(RF4)
NetU504_9: U504.9(RF1) U506.11(RF2)
NetU505_7: U505.7(ANT) ; port HF_PORT2
NetU506_7: U506.7(ANT) ; port HF_PORT1

Not connected (* = marked no-connect by the designer): U507 13(TEMP)*

### Buses and harness runs
harness RF_Detector = port RF_Detector
harness RF_SW_CPLR_1 = port RF_SW_CPLR_1
harness RF_SW_CPLR_2 = port RF_SW_CPLR_2
harness RF_SW_CPLR_3 = port RF_SW_CPLR_3
harness RF_SW_CPLR_4 = port RF_SW_CPLR_4
harness RF_SW_CPLR_5 = port RF_SW_CPLR_5
harness RF_SW_CPLR_6 = port RF_SW_CPLR_6

### Layout directives
net class SE_50: (no net found under the mark), NetC501_2, NetC502_2, NetC521_2, NetC522_2, NetC533_1, NetC533_2, NetC534_1, NetC534_2, NetU505_7, NetU506_7, RF_COUPLED
net class 0.2A: (no net found under the mark)

### Notes on the sheet
- (near R524) -5.6dB
- (near U507) BW_output = 5kHz
  Cflt = 20nF
- -5.6dB
- P_r50e_max -> 12dBm -> 15.85mW
- T-Pad calculated with: https://www.allaboutcircuits.com/tools/t-pad-attenuator-calculator/
- VERTRAULICH   CONFIDENTIAL   Copyright by Spacetek Technology AG. Für dieses Dokument behalten wir uns alle Rechte vor. We reserve all rights in respect of this document.
- Project:
- Number:
- Variant:
- Version:
- Git:
- Board:
- Page:
- Release:
- Size:
- Sheet
- A3
- of
- Design:
- Check:
- File:

### Library data of the parts
C501 C502 C521 C522 C533 C534 = CMP-010-000105-1: Capacitor ceramic 470p 50V 5% C0G  SMD--0402; Manufacturer: TDK; Partnumber: CGA2B2C0G1H471J050BA; Component Category: Generic; Meta Data Version: v1.0; Status: released; Value: 470p
C503 C504 C507 C508 C510-C513 C515-C518 C523 C524 C527 C528 = CMP-010-000109-1: Capacitor ceramic 100p 50V 5% C0G AEC-Q200 SMD--0402; Partnumber: CL05C101JB51PND; Manufacturer: Samsung Electro-Mechanics; Component Category: Generic; Meta Data Version: v1.0; Package: SMD--0402; Status: released; Type: Capacitor ceramic; Value: 100p
C505 C506 C509 C514 C519 C520 C525 C526 C529 C530 = 200032-3: Capacitor ceramic 100n 16V 10% X7R  SMD--0402; Partnumber: CL05B104KO5NNNC; Manufacturer: Samsung Electro-Mechanics; A-Number: 200032; Material: X7R; Voltage: 16V; Type: Capacitor ceramic; Tolerance: 10%; Status: released; Package: SMD--0402; Value: 100n
C531 C532 = CMP-010-000007-3: Capacitor ceramic 10n 35V 2% C0G SMD--0402; Manufacturer: Murata Electronics; Partnumber: GRM1555CYA103GE01; A-Number: 200032; Voltage: 35V; Status: released; Tolerance: 2%; Type: Capacitor ceramic; Package: SMD--0402; Material: C0G; Value: 10n
FL501 = CMP-042-000029-3: Directional Coupler, 50 MHz to 6 GHz, 50 Ohms, SMD; Manufacturer: Mini-Circuits; Meta Data Version: v1.0; Component Category: Generic; Status: released; Type: Directional Coupler; Partnumber: SEDC-10-63+; Value: SEDC-10-63+
L501-L508 = 300015-1: Ferrit Bead MPZ1005S330HT000 33E 3A 22mE SMD--0402; Manufacturer: TDK Group; preferred: Yes; A-Number: 300015; Status: active; Current: 3A; Type: Ferrit Bead; Value: 33E; Package: MPZ1005S330HT000; Special: 22mE; Partnumber: MPZ1005S330HT000
R501-R508 R511-R514 R517 R518 R521 R522 R525-R528 R531-R534 R536 = 100086-1: Resistor 10k 50V  0.063W 1%  SMD--0402; Partnumber: ERJ-2RKF1002X; Manufacturer: Panasonic; A-Number: 100086; Power: 0.063W; Status: released; Type: Resistor; Voltage: 50V; Tolerance: 1%; Value: 10k; Package: SMD--0402
R509 R510 R529 R530 = CMP-009-000262-1: Resistor 49.9E 50V 0.1W 1% SMD--0402; Partnumber: RNCP0402FTD49R9; Manufacturer: SEI Stackpole; Component Category: Generic; Meta Data Version: v1.0; Value: 49.9E; Status: released
R515 R516 R523 R524 = CMP-009-000261-1: Resistor 15.4E 50V 0.1W 0.1% SMD--0402; Manufacturer: TE Connectivity; Partnumber: RP73PF1E15R4BTDF; Component Category: Generic; Meta Data Version: v1.0; Value: 15.4E; Status: released
R519 R520 = CMP-009-000263-1: Resistor 71.5E 50V 0.0625W 0.1% SMD--0402; Manufacturer: Panasonic; Partnumber: ERA-2AEB71R5X; Component Category: Generic; Meta Data Version: v1.0; Value: 71.5E; Status: released
R535 = CMP-009-000265-1: Resistor 52.3E 50V 0.1W 0.1% SMD--0402; Partnumber: RP73PF1E52R3BTD; Manufacturer: TE Connectivity; Component Category: Generic; Meta Data Version: v1.0; Type: Resistor; Value: 52.3E; Status: released
R537 R538 = 100077-2: Resistor 1k 50V  0.063W 1%  SMD--0402; Partnumber: ERJ-2RKF1001X; Manufacturer: Panasonic; A-Number: 100077; Power: 0.063W; Value: 1k; Status: released; Package: SMD--0402; Type: Resistor; Tolerance: 1%; Voltage: 50V
R539 = 100089-1: Resistor 499E 50V  0.063W 1%  SMD--0402; Manufacturer: Yageo; Partnumber: RC0402FR-07499RL; A-Number: 100089; Value: 499E; Voltage: 50V; Tolerance: 1%; Package: SMD--0402; Status: released; Power: 0.063W; Type: Resistor
U501-U506 = CMP-081-000011-1: RF Switch RFSW6042TR7  5-6000MHz SP4T Iso 36dB @925MHz; Manufacturer: Qorvo; Component Category: Generic; Meta Data Version: v1.0; Partnumber: RFSW6042TR7; Status: released; Value: RFSW6042TR7; Type: RF-Switch
U507 = CMP-042-000030-1: HF-Detector 1MHz to 8GHz; Manufacturer: Analog Devices; Meta Data Version: v1.0; Component Category: Generic; Value: AD8318SCPZ-EP-RL7; Partnumber: AD8318SCPZ-EP-RL7; Type: HF-Detector; Status: released

## Sheet 6 RF Ports.SchDoc: RF Ports
size A3; PageSetup: Record=PageOptions|CenterHorizontal=True|CenterVertical=True|PrintScale=1.01|XCorrection=1.00|YCorrection=1.00|PrintKind=2|BorderSize=5000000|LeftOffset=0|BottomOffset=0|Orientation=2|PaperLength=1000|PaperWidth=1000|Scale=100|PaperSource=15|PrintQuality=600|MediaType=1|DitherType=10|PaperKind=A3|PrintScaleMode=1; DocumentNumber: 4; SheetNumber: 7; SheetTotal: 7
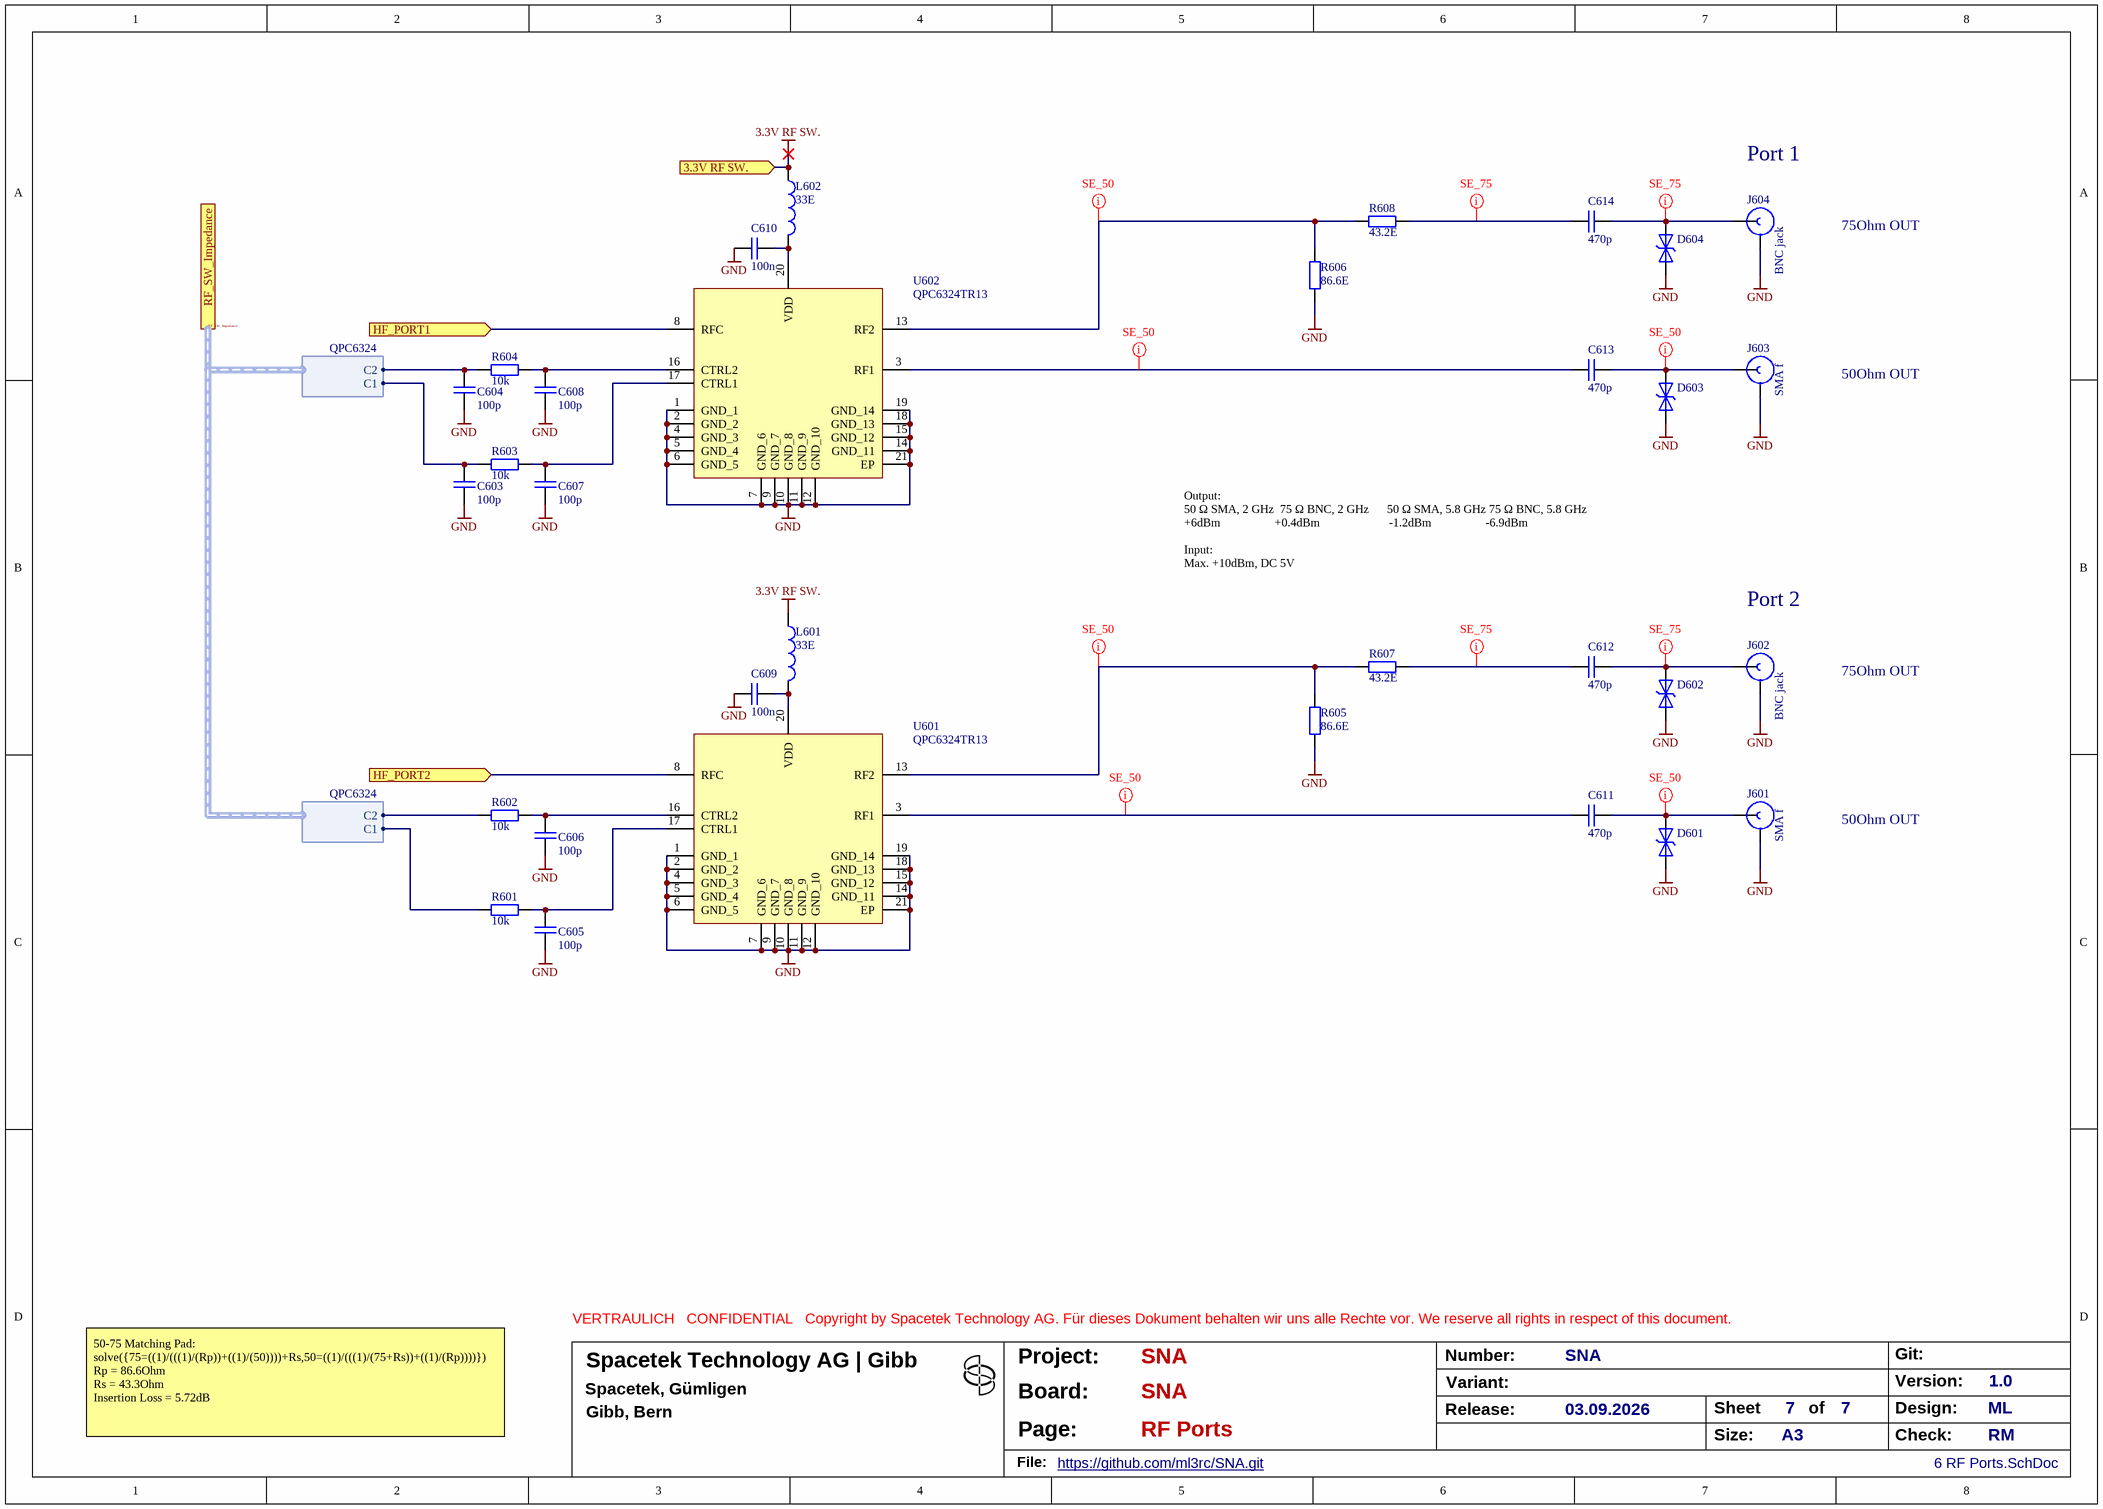
[diagram p6: 6 RF Ports.SchDoc]

### Parts
C603  100p  [STT--CC--0402]
C604  100p  [STT--CC--0402]
C605  100p  [STT--CC--0402]
C606  100p  [STT--CC--0402]
C607  100p  [STT--CC--0402]
C608  100p  [STT--CC--0402]
C609  100n  [STT--CC--0402]
C610  100n  [STT--CC--0402]
C611  470p  [STT--CC--0402]
C612  470p  [STT--CC--0402]
C613  470p  [STT--CC--0402]
C614  470p  [STT--CC--0402]
D601  SESD0402X1BN-0010-098  [LF--SD--0402R]  (value not drawn)
D602  SESD0402X1BN-0010-098  [LF--SD--0402R]  (value not drawn)
D603  SESD0402X1BN-0010-098  [LF--SD--0402R]  (value not drawn)
D604  SESD0402X1BN-0010-098  [LF--SD--0402R]  (value not drawn)
J601  SMA f  [STT--CO--142-0701-871]
J602  BNC jack  [SAM--CO--BNC7T-J-P-GN-RA-BM1D]
J603  SMA f  [STT--CO--142-0701-871]
J604  BNC jack  [SAM--CO--BNC7T-J-P-GN-RA-BM1D]
L601  33E  [STT--FB--0402]
L602  33E  [STT--FB--0402]
R601  10k  [STT--RC--0402]
R602  10k  [STT--RC--0402]
R603  10k  [STT--RC--0402]
R604  10k  [STT--RC--0402]
R605  86.6E  [STT--RC--0402]
R606  86.6E  [STT--RC--0402]
R607  43.2E  [STT--RC--0402]
R608  43.2E  [STT--RC--0402]
U601  QPC6324TR13  [QV--IC--QFN-20]
U602  QPC6324TR13  [QV--IC--QFN-20]

### Ports
3.3V RF SW. (in), HF_PORT1 (in), HF_PORT2 (in), RF_SW_Impedance (harness QPC6324)

### Harnesses
QPC6324: C1, C2

### Nets
3.3V RF SW.: L601.1 L602.1 ; port 3.3V RF SW.
GND: C603.1 C604.1 C605.1 C606.1 C607.1 C608.1 C609.1 C610.1 D601.1 D602.1 D603.1 D604.1 J601.0 J602.0 J603.0 J604.0 R605.2 R606.2 U601.1(GND_1) U601.2(GND_2) U601.4(GND_3) U601.5(GND_4) U601.6(GND_5) U601.7(GND_6) U601.9(GND_7) U601.10(GND_8) U601.11(GND_9) U601.12(GND_10) U601.14(GND_11) U601.15(GND_12) U601.18(GND_13) U601.19(GND_14) U601.21(EP) U602.1(GND_1) U602.2(GND_2) U602.4(GND_3) U602.5(GND_4) U602.6(GND_5) U602.7(GND_6) U602.9(GND_7) U602.10(GND_8) U602.11(GND_9) U602.12(GND_10) U602.14(GND_11) U602.15(GND_12) U602.18(GND_13) U602.19(GND_14) U602.21(EP)
RF_SW_Impedance.C1: C603.2 R601.2 R603.2 ; port RF_SW_Impedance.C1
RF_SW_Impedance.C2: C604.2 R602.2 R604.2 ; port RF_SW_Impedance.C2
NetC605_2: C605.2 R601.1 U601.17(CTRL1)
NetC606_2: C606.2 R602.1 U601.16(CTRL2)
NetC607_2: C607.2 R603.1 U602.17(CTRL1)
NetC608_2: C608.2 R604.1 U602.16(CTRL2)
NetC609_2: C609.2 L601.2 U601.20(VDD)
NetC610_2: C610.2 L602.2 U602.20(VDD)
NetC611_1: C611.1 U601.3(RF1)
NetC611_2: C611.2 D601.2 J601.1
NetC612_1: C612.1 R607.1
NetC612_2: C612.2 D602.2 J602.1
NetC613_1: C613.1 U602.3(RF1)
NetC613_2: C613.2 D603.2 J603.1
NetC614_1: C614.1 R608.1
NetC614_2: C614.2 D604.2 J604.1
NetR605_1: R605.1 R607.2 U601.13(RF2)
NetR606_1: R606.1 R608.2 U602.13(RF2)
NetU505_7: U601.8(RFC) ; port HF_PORT2
NetU506_7: U602.8(RFC) ; port HF_PORT1

### Buses and harness runs
harness RF_SW_Impedance = port RF_SW_Impedance

### Layout directives
net class SE_50: NetC611_1, NetC611_2, NetC613_1, NetC613_2, NetR605_1, NetR606_1
net class SE_75: NetC612_1, NetC612_2, NetC614_1, NetC614_2

### Notes on the sheet
- Port 1
- 75Ohm OUT
- 50Ohm OUT
- Output:
  50 Ω SMA, 2 GHz 	75 Ω BNC, 2 GHz	     50 Ω SMA, 5.8 GHz	75 Ω BNC, 5.8 GHz
  +6dBm	                 +0.4dBm	                      -1.2dBm	                 -6.9dBm
  Input:
  Max. +10dBm, DC 5V
- Port 2
- 50-75 Matching Pad:
  solve({75=((1)/(((1)/(Rp))+((1)/(50))))+Rs,50=((1)/(((1)/(75+Rs))+((1)/(Rp))))})
  Rp = 86.6Ohm
  Rs = 43.3Ohm
  Insertion Loss = 5.72dB
- VERTRAULICH   CONFIDENTIAL   Copyright by Spacetek Technology AG. Für dieses Dokument behalten wir uns alle Rechte vor. We reserve all rights in respect of this document.
- Project:
- Number:
- Variant:
- Version:
- Git:
- Board:
- Page:
- Release:
- Size:
- Sheet
- A3
- of
- Design:
- Check:
- File:

### Library data of the parts
C603-C608 = CMP-010-000109-1: as C503 on sheet 5 RF Directional Coupler; Package: SMD--0402; Status: released; Type: Capacitor ceramic; Value: 100p
C609 C610 = 200032-3: as C505 on sheet 5 RF Directional Coupler; Material: X7R; Voltage: 16V; Type: Capacitor ceramic; Tolerance: 10%; Status: released; Package: SMD--0402; Value: 100n
C611-C614 = CMP-010-000105-1: as C501 on sheet 5 RF Directional Coupler; Status: released; Value: 470p
D601-D604 = CMP-039-000055-1: TVS Diode, 7V, 0.1pF; Manufacturer: Littelfuse; Meta Data Version: v1.0; Component Category: Generic; Type: TVS Diode; Partnumber: SESD0402X1BN-0010-098; Status: released; Value: SESD0402X1BN-0010-098
J601 J603 = 600000-2: Connector Coaxial 142-0701-871 SMA f  Edge--142-0701-871; Manufacturer: Chinch Connectivity Solutions Johnson; preferred: yes; A-Number: 600000; E-Number: E-000'342; Status: active; Partnumber: 142-0701-871; Type: Connector Coaxial; Value: SMA f; Package: Edge--142-0701-871
J602 J604 = CMP-023-000176-1: Connector Coaxial BNC7T-J-P-GN-RA-BM1D BNC jack right angle 75Ohm; Manufacturer: Samtec; Meta Data Version: v1.0; Component Category: Generic; Type: Connector Coaxial; Special: right angle; Value: BNC jack; Status: released; Partnumber: BNC7T-J-P-GN-RA-BM1D
L601 L602 = 300015-1: as L501-L508 on sheet 5 RF Directional Coupler; Status: active; Current: 3A; Type: Ferrit Bead; Value: 33E; Package: MPZ1005S330HT000; Special: 22mE; Partnumber: MPZ1005S330HT000
R601-R604 = 100086-1: as R501-R508 on sheet 5 RF Directional Coupler; Power: 0.063W; Status: released; Type: Resistor; Voltage: 50V; Tolerance: 1%; Value: 10k; Package: SMD--0402
R605 R606 = CMP-009-000267-1: Resistor 86.6E 50V 0.1W 0.1% SMD--0402; Manufacturer: TE Connectivity; Partnumber: RP73PF1E86R6BTD; Meta Data Version: v1.0; Component Category: Generic; Value: 86.6E; Type: Resistor; Status: released
R607 R608 = CMP-009-000266-1: Resistor 43.2E 50V 0.1W 0.1% SMD--0402; Manufacturer: TE Connectivity; Partnumber: RP73PF1E43R2BTD; Component Category: Generic; Meta Data Version: v1.0; Status: released; Value: 43.2E; Type: Resistor
U601 U602 = CMP-081-000012-1: RF Switch QPC6324TR13  5-6000MHz SPDT; Manufacturer: Qorvo; Component Category: Generic; Meta Data Version: v1.0; Value: QPC6324TR13; Partnumber: QPC6324TR13; Status: released; Type: RF-Switch

## Nets that join several sheets
3.3V: 1 Power (R107.2), 2 MCU (32 pins)
3.3V RF ATTEN-AMP: 1 Power (R113.2), 4 RF Attenuation Amp (6 pins)
3.3V RF SRC - CP: 1 Power (R114.2), 3 RF Source (5 pins)
3.3V RF SRC - RF: 1 Power (R115.2), 3 RF Source (L303.1)
3.3V RF SW.: 1 Power (R112.2), 5 RF Directional Coupler (6 pins), 6 RF Ports (L601.1 L602.1)
5V: 1 Power (8 pins), 2 MCU (Q201.1 Q201.2 Q201.3 TP201.1)
5V RF Log Det.: 1 Power (R109.2), 5 RF Directional Coupler (L507.1 L508.1)
GND: 0 Overview (23 pins), 1 Power (48 pins), 2 MCU (64 pins), 3 RF Source (59 pins), 4 RF Attenuation Amp (97 pins), 5 RF Directional Coupler (83 pins), 6 RF Ports (48 pins)
NetC329_2: 3 RF Source (C329.2), 4 RF Attenuation Amp (U401.5)
NetC419_2: 2 MCU (R241.2), 4 RF Attenuation Amp (C419.2 R409.1)
NetC501_1: 4 RF Attenuation Amp (U405.3), 5 RF Directional Coupler (C501.1)
NetC502_1: 4 RF Attenuation Amp (U404.13), 5 RF Directional Coupler (C502.1)
NetU505_7: 5 RF Directional Coupler (U505.7), 6 RF Ports (U601.8)
NetU506_7: 5 RF Directional Coupler (U506.7), 6 RF Ports (U602.8)
RF_Detector.OUT: 2 MCU (C204.2 D205.1), 5 RF Directional Coupler (C527.2 R537.2)

## Assembly variants
EMS: all parts fitted